# Altium schematic sheet SMALL_BCM.SchDoc
size A2; SheetNumber: 2; SheetTotal: 13
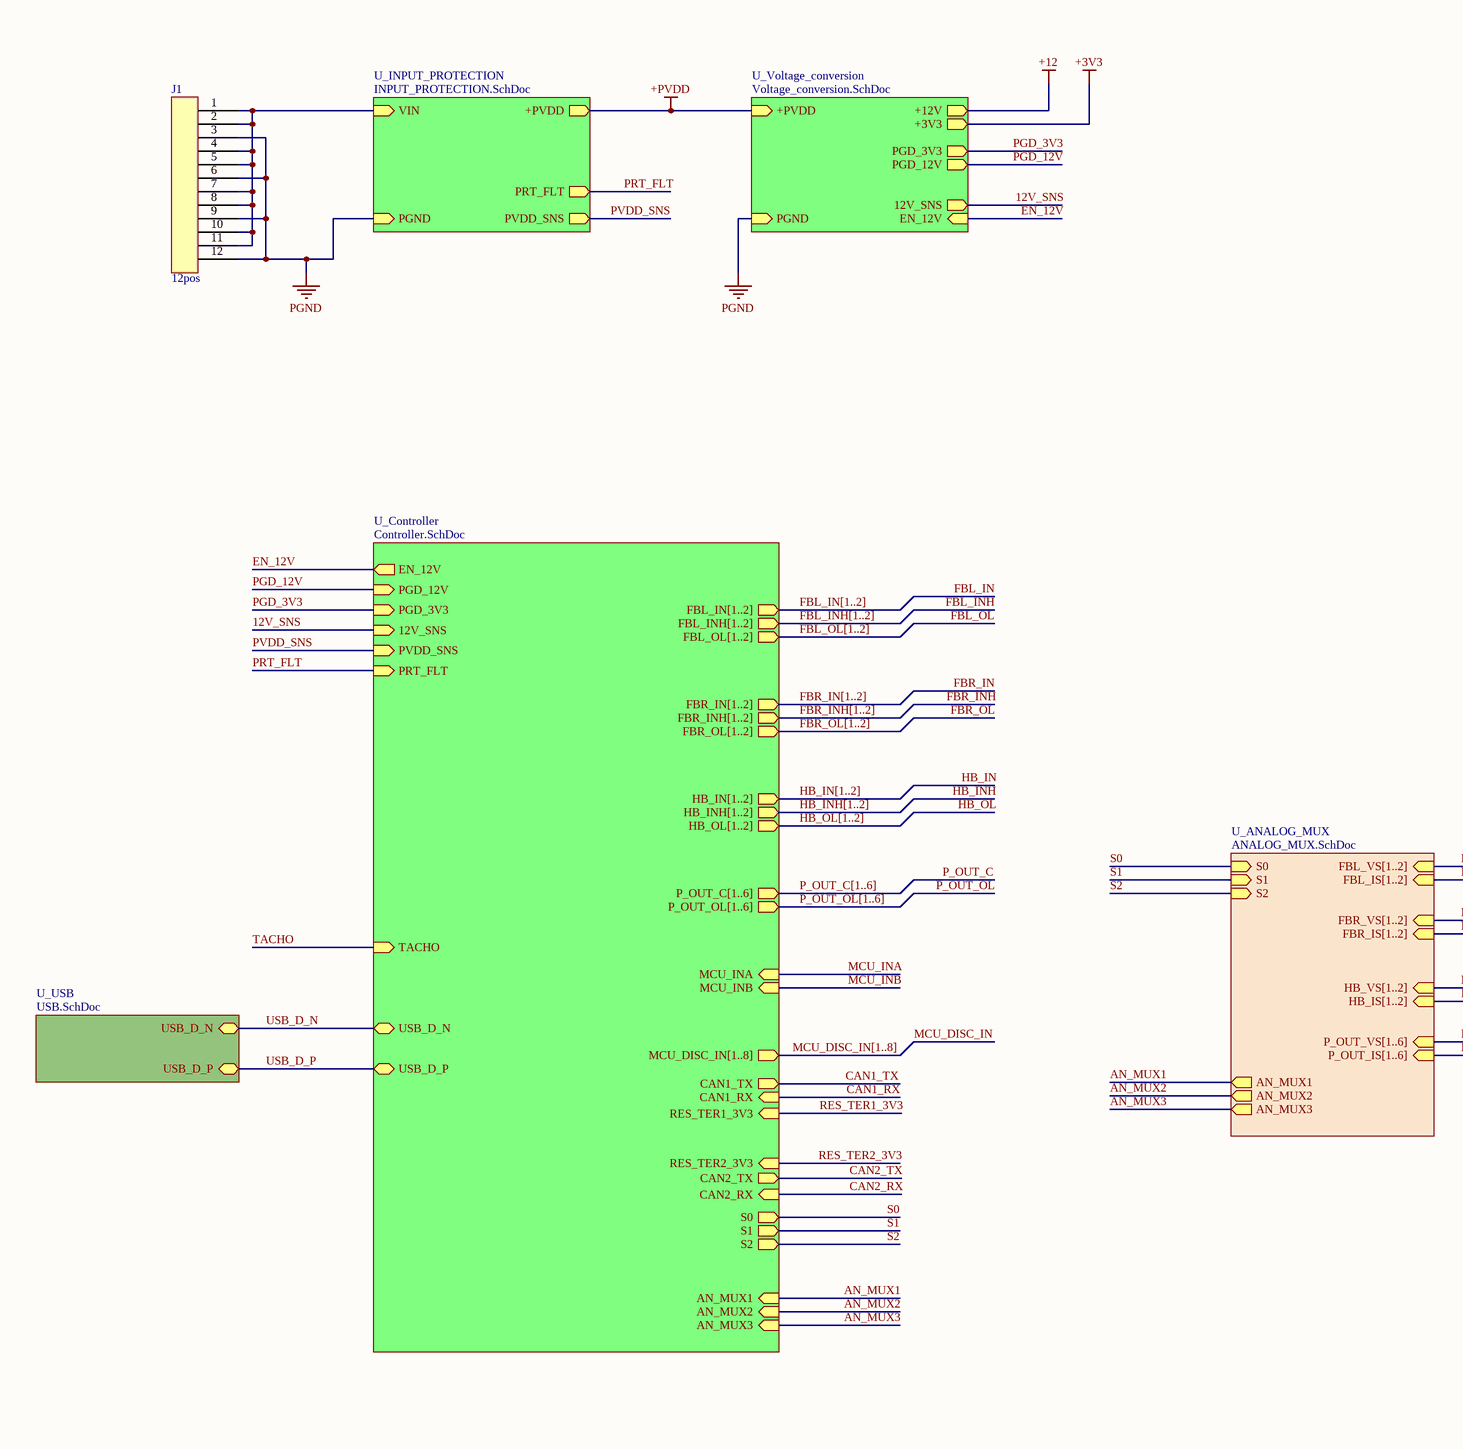
[diagram p0: SMALL_BCM.SchDoc, left]
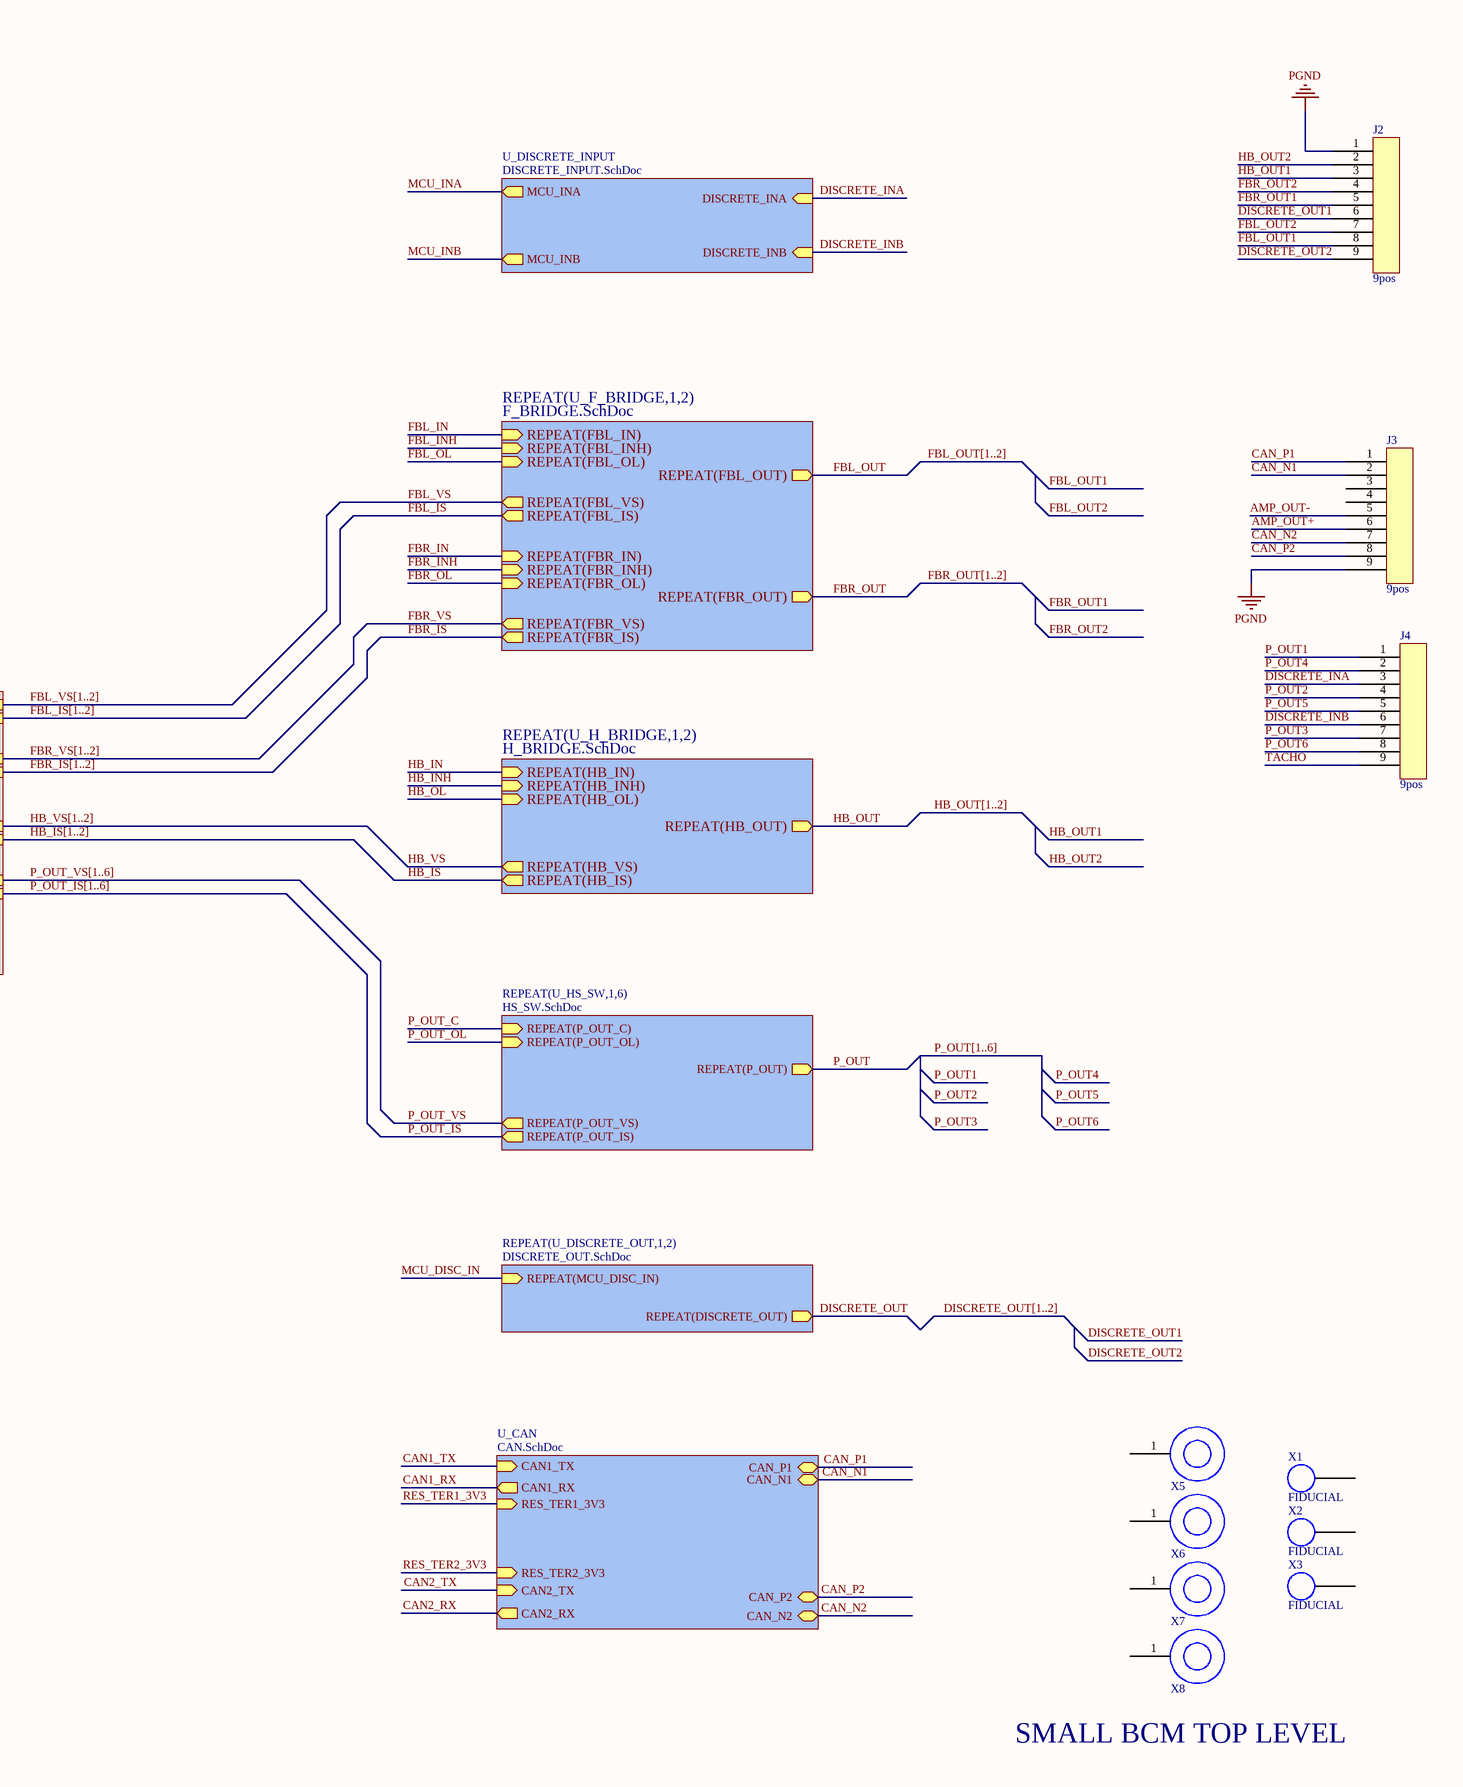
[diagram p1: SMALL_BCM.SchDoc, right]

## Parts
J1  12pos  [9-966140-3]
J2  9pos  [9-966140-4]
J3  9pos  [9-966140-4]
J4  9pos  [9-966140-4]
X1  FIDUCIAL  [FIDUCIAL]  (no BOM)
X2  FIDUCIAL  [FIDUCIAL]  (no BOM)
X3  FIDUCIAL  [FIDUCIAL]  (no BOM)
X5  M3  [FIXING_M3]  (value not drawn)  (no BOM)
X6  M3  [FIXING_M3]  (value not drawn)  (no BOM)
X7  M3  [FIXING_M3]  (value not drawn)  (no BOM)
X8  M3  [FIXING_M3]  (value not drawn)  (no BOM)

## Sub-sheets
REPEAT(U_DISCRETE_OUT,1,2) = DISCRETE_OUT.SchDoc: REPEAT(MCU_DISC_IN) (in), REPEAT(DISCRETE_OUT) (out)
REPEAT(U_F_BRIDGE,1,2) = F_BRIDGE.SchDoc: REPEAT(FBL_IN) (in), REPEAT(FBL_INH) (in), REPEAT(FBL_OL) (in), REPEAT(FBL_OUT) (out), REPEAT(FBL_VS) (out), REPEAT(FBL_IS) (out), REPEAT(FBR_IN) (in), REPEAT(FBR_INH) (in), REPEAT(FBR_OL) (in), REPEAT(FBR_OUT) (out), REPEAT(FBR_VS) (out), REPEAT(FBR_IS) (out)
REPEAT(U_H_BRIDGE,1,2) = H_BRIDGE.SchDoc: REPEAT(HB_IN) (in), REPEAT(HB_INH) (in), REPEAT(HB_IS) (out), REPEAT(HB_OL) (in), REPEAT(HB_OUT) (out), REPEAT(HB_VS) (out)
REPEAT(U_HS_SW,1,6) = HS_SW.SchDoc: REPEAT(P_OUT) (out), REPEAT(P_OUT_VS) (out), REPEAT(P_OUT_IS) (out), REPEAT(P_OUT_OL) (in), REPEAT(P_OUT_C) (in)
U_ANALOG_MUX = ANALOG_MUX.SchDoc: AN_MUX1 (out), AN_MUX2 (out), AN_MUX3 (out), S0 (in), S1 (in), S2 (in), FBR_VS[1..2] (in), FBL_VS[1..2] (in), P_OUT_VS[1..6] (in), P_OUT_IS[1..6] (in), HB_IS[1..2] (in), HB_VS[1..2] (in), FBL_IS[1..2] (in), FBR_IS[1..2] (in)
U_CAN = CAN.SchDoc: CAN_P1 (bidir), CAN_N1 (bidir), CAN1_TX (in), CAN1_RX (out), CAN_P2 (bidir), CAN_N2 (bidir), CAN2_TX (in), CAN2_RX (out), RES_TER1_3V3 (in), RES_TER2_3V3 (in)
U_Controller = Controller.SchDoc: CAN1_RX (in), CAN1_TX (out), USB_D_N (bidir), USB_D_P (bidir), HB_INH[1..2] (out), MCU_DISC_IN[1..8] (out), FBR_OL[1..2] (out), FBL_IN[1..2] (out), HB_IN[1..2] (out), 12V_SNS (in), FBL_INH[1..2] (out), HB_OL[1..2] (out), P_OUT_C[1..6] (out), MCU_INB (in), P_OUT_OL[1..6] (out), PGD_12V (in), FBL_OL[1..2] (out), MCU_INA (in), PGD_3V3 (in), FBR_INH[1..2] (out), EN_12V (out), FBR_IN[1..2] (out), S1 (out), S0 (out), S2 (out), AN_MUX3 (in), AN_MUX2 (in), AN_MUX1 (in), PVDD_SNS (in), PRT_FLT (in), TACHO (in), CAN2_RX (in), CAN2_TX (out), RES_TER2_3V3 (in), RES_TER1_3V3 (in)
U_DISCRETE_INPUT = DISCRETE_INPUT.SchDoc: MCU_INB (out), MCU_INA (out), DISCRETE_INA (in), DISCRETE_INB (in)
U_INPUT_PROTECTION = INPUT_PROTECTION.SchDoc: VIN (in), PGND (in), +PVDD (out), PRT_FLT (out), PVDD_SNS (out)
U_USB = USB.SchDoc: USB_D_N (bidir), USB_D_P (bidir)
U_Voltage_conversion = Voltage_conversion.SchDoc: +PVDD (in), PGND (in), +12V (out), PGD_12V (out), +3V3 (out), PGD_3V3 (out), 12V_SNS (out), EN_12V (in)

## Nets
+3V3: sheet U_Voltage_conversion/+3V3
+12: sheet U_Voltage_conversion/+12V
+PVDD: sheet U_INPUT_PROTECTION/+PVDD, sheet U_Voltage_conversion/+PVDD
PGND: J1.3 J1.6 J1.9 J1.12 J2.1 J3.9 ; sheet U_INPUT_PROTECTION/PGND, sheet U_Voltage_conversion/PGND
12V_SNS: sheet U_Voltage_conversion/12V_SNS, sheet U_Controller/12V_SNS
AMP_OUT+: J3.6
AMP_OUT-: J3.5
AN_MUX1: sheet U_Controller/AN_MUX1, sheet U_ANALOG_MUX/AN_MUX1
AN_MUX2: sheet U_Controller/AN_MUX2, sheet U_ANALOG_MUX/AN_MUX2
AN_MUX3: sheet U_Controller/AN_MUX3, sheet U_ANALOG_MUX/AN_MUX3
CAN1_RX: sheet U_Controller/CAN1_RX, sheet U_CAN/CAN1_RX
CAN1_TX: sheet U_Controller/CAN1_TX, sheet U_CAN/CAN1_TX
CAN2_RX: sheet U_Controller/CAN2_RX, sheet U_CAN/CAN2_RX
CAN2_TX: sheet U_Controller/CAN2_TX, sheet U_CAN/CAN2_TX
CAN_N1: J3.2 ; sheet U_CAN/CAN_N1
CAN_N2: J3.7 ; sheet U_CAN/CAN_N2
CAN_P1: J3.1 ; sheet U_CAN/CAN_P1
CAN_P2: J3.8 ; sheet U_CAN/CAN_P2
DISCRETE_INA: J4.3 ; sheet U_DISCRETE_INPUT/DISCRETE_INA
DISCRETE_INB: J4.6 ; sheet U_DISCRETE_INPUT/DISCRETE_INB
DISCRETE_OUT: sheet REPEAT(U_DISCRETE_OUT,1,2)/REPEAT(DISCRETE_OUT)
DISCRETE_OUT1: J2.6
DISCRETE_OUT2: J2.9
EN_12V: sheet U_Voltage_conversion/EN_12V, sheet U_Controller/EN_12V
FBL_IN: sheet REPEAT(U_F_BRIDGE,1,2)/REPEAT(FBL_IN)
FBL_INH: sheet REPEAT(U_F_BRIDGE,1,2)/REPEAT(FBL_INH)
FBL_IS: sheet REPEAT(U_F_BRIDGE,1,2)/REPEAT(FBL_IS)
FBL_OL: sheet REPEAT(U_F_BRIDGE,1,2)/REPEAT(FBL_OL)
FBL_OUT: sheet REPEAT(U_F_BRIDGE,1,2)/REPEAT(FBL_OUT)
FBL_OUT1: J2.8
FBL_OUT2: J2.7
FBL_VS: sheet REPEAT(U_F_BRIDGE,1,2)/REPEAT(FBL_VS)
FBR_IN: sheet REPEAT(U_F_BRIDGE,1,2)/REPEAT(FBR_IN)
FBR_INH: sheet REPEAT(U_F_BRIDGE,1,2)/REPEAT(FBR_INH)
FBR_IS: sheet REPEAT(U_F_BRIDGE,1,2)/REPEAT(FBR_IS)
FBR_OL: sheet REPEAT(U_F_BRIDGE,1,2)/REPEAT(FBR_OL)
FBR_OUT: sheet REPEAT(U_F_BRIDGE,1,2)/REPEAT(FBR_OUT)
FBR_OUT1: J2.5
FBR_OUT2: J2.4
FBR_VS: sheet REPEAT(U_F_BRIDGE,1,2)/REPEAT(FBR_VS)
HB_IN: sheet REPEAT(U_H_BRIDGE,1,2)/REPEAT(HB_IN)
HB_INH: sheet REPEAT(U_H_BRIDGE,1,2)/REPEAT(HB_INH)
HB_IS: sheet REPEAT(U_H_BRIDGE,1,2)/REPEAT(HB_IS)
HB_OL: sheet REPEAT(U_H_BRIDGE,1,2)/REPEAT(HB_OL)
HB_OUT: sheet REPEAT(U_H_BRIDGE,1,2)/REPEAT(HB_OUT)
HB_OUT1: J2.3
HB_OUT2: J2.2
HB_VS: sheet REPEAT(U_H_BRIDGE,1,2)/REPEAT(HB_VS)
MCU_DISC_IN: sheet REPEAT(U_DISCRETE_OUT,1,2)/REPEAT(MCU_DISC_IN)
MCU_INA: sheet U_Controller/MCU_INA, sheet U_DISCRETE_INPUT/MCU_INA
MCU_INB: sheet U_Controller/MCU_INB, sheet U_DISCRETE_INPUT/MCU_INB
P_OUT: sheet REPEAT(U_HS_SW,1,6)/REPEAT(P_OUT)
P_OUT1: J4.1
P_OUT2: J4.4
P_OUT3: J4.7
P_OUT4: J4.2
P_OUT5: J4.5
P_OUT6: J4.8
P_OUT_C: sheet REPEAT(U_HS_SW,1,6)/REPEAT(P_OUT_C)
P_OUT_IS: sheet REPEAT(U_HS_SW,1,6)/REPEAT(P_OUT_IS)
P_OUT_OL: sheet REPEAT(U_HS_SW,1,6)/REPEAT(P_OUT_OL)
P_OUT_VS: sheet REPEAT(U_HS_SW,1,6)/REPEAT(P_OUT_VS)
PGD_3V3: sheet U_Voltage_conversion/PGD_3V3, sheet U_Controller/PGD_3V3
PGD_12V: sheet U_Voltage_conversion/PGD_12V, sheet U_Controller/PGD_12V
PRT_FLT: sheet U_INPUT_PROTECTION/PRT_FLT, sheet U_Controller/PRT_FLT
PVDD_SNS: sheet U_INPUT_PROTECTION/PVDD_SNS, sheet U_Controller/PVDD_SNS
RES_TER1_3V3: sheet U_Controller/RES_TER1_3V3, sheet U_CAN/RES_TER1_3V3
RES_TER2_3V3: sheet U_Controller/RES_TER2_3V3, sheet U_CAN/RES_TER2_3V3
S0: sheet U_Controller/S0, sheet U_ANALOG_MUX/S0
S1: sheet U_Controller/S1, sheet U_ANALOG_MUX/S1
S2: sheet U_Controller/S2, sheet U_ANALOG_MUX/S2
TACHO: J4.9 ; sheet U_Controller/TACHO
USB_D_N: sheet U_USB/USB_D_N, sheet U_Controller/USB_D_N
USB_D_P: sheet U_USB/USB_D_P, sheet U_Controller/USB_D_P
NetJ1_1: J1.1 J1.2 J1.4 J1.5 J1.7 J1.8 J1.10 J1.11 ; sheet U_INPUT_PROTECTION/VIN

Not connected (* = marked no-connect by the designer): J3 3 4; X1 1; X2 1; X3 1; X5 1; X6 1; X7 1; X8 1

## Buses and harness runs
bus DISCRETE_OUT[1..2]
bus FBL_IN[1..2] = sheet U_Controller/FBL_IN[1..2]
bus FBL_INH[1..2] = sheet U_Controller/FBL_INH[1..2]
bus FBL_IS[1..2] = sheet U_ANALOG_MUX/FBL_IS[1..2]
bus FBL_OL[1..2] = sheet U_Controller/FBL_OL[1..2]
bus FBL_OUT[1..2]
bus FBL_VS[1..2] = sheet U_ANALOG_MUX/FBL_VS[1..2]
bus FBR_IN[1..2] = sheet U_Controller/FBR_IN[1..2]
bus FBR_INH[1..2] = sheet U_Controller/FBR_INH[1..2]
bus FBR_IS[1..2] = sheet U_ANALOG_MUX/FBR_IS[1..2]
bus FBR_OL[1..2] = sheet U_Controller/FBR_OL[1..2]
bus FBR_OUT[1..2]
bus FBR_VS[1..2] = sheet U_ANALOG_MUX/FBR_VS[1..2]
bus HB_IN[1..2] = sheet U_Controller/HB_IN[1..2]
bus HB_INH[1..2] = sheet U_Controller/HB_INH[1..2]
bus HB_IS[1..2] = sheet U_ANALOG_MUX/HB_IS[1..2]
bus HB_OL[1..2] = sheet U_Controller/HB_OL[1..2]
bus HB_OUT[1..2]
bus HB_VS[1..2] = sheet U_ANALOG_MUX/HB_VS[1..2]
bus MCU_DISC_IN[1..8] = sheet U_Controller/MCU_DISC_IN[1..8]
bus P_OUT[1..6]
bus P_OUT_C[1..6] = sheet U_Controller/P_OUT_C[1..6]
bus P_OUT_IS[1..6] = sheet U_ANALOG_MUX/P_OUT_IS[1..6]
bus P_OUT_OL[1..6] = sheet U_Controller/P_OUT_OL[1..6]
bus P_OUT_VS[1..6] = sheet U_ANALOG_MUX/P_OUT_VS[1..6]

## Notes on the sheet
- SMALL BCM TOP LEVEL

## Library data of the parts
J1 = 3x4_9-966140-3: CONN HEADER R/A 12POS 5MM; Order Code: DIGI : A126711-ND; P/N: 9-966140-3; Value: 12pos
J2-J4 = 3x4_9-966140-4: CONN HEADER R/A 9POS 5MM; Order Code: DIGI : A122202-ND; P/N: 9-966140-4; Value: 9pos
X1-X3 = FIDUCIAL: FIDUCIAL 1mm
X5-X8 = FIXING_M3: FIXING HOLE M3; Value: M3